# Altium schematic sheet NRF51822.SchDoc
size A
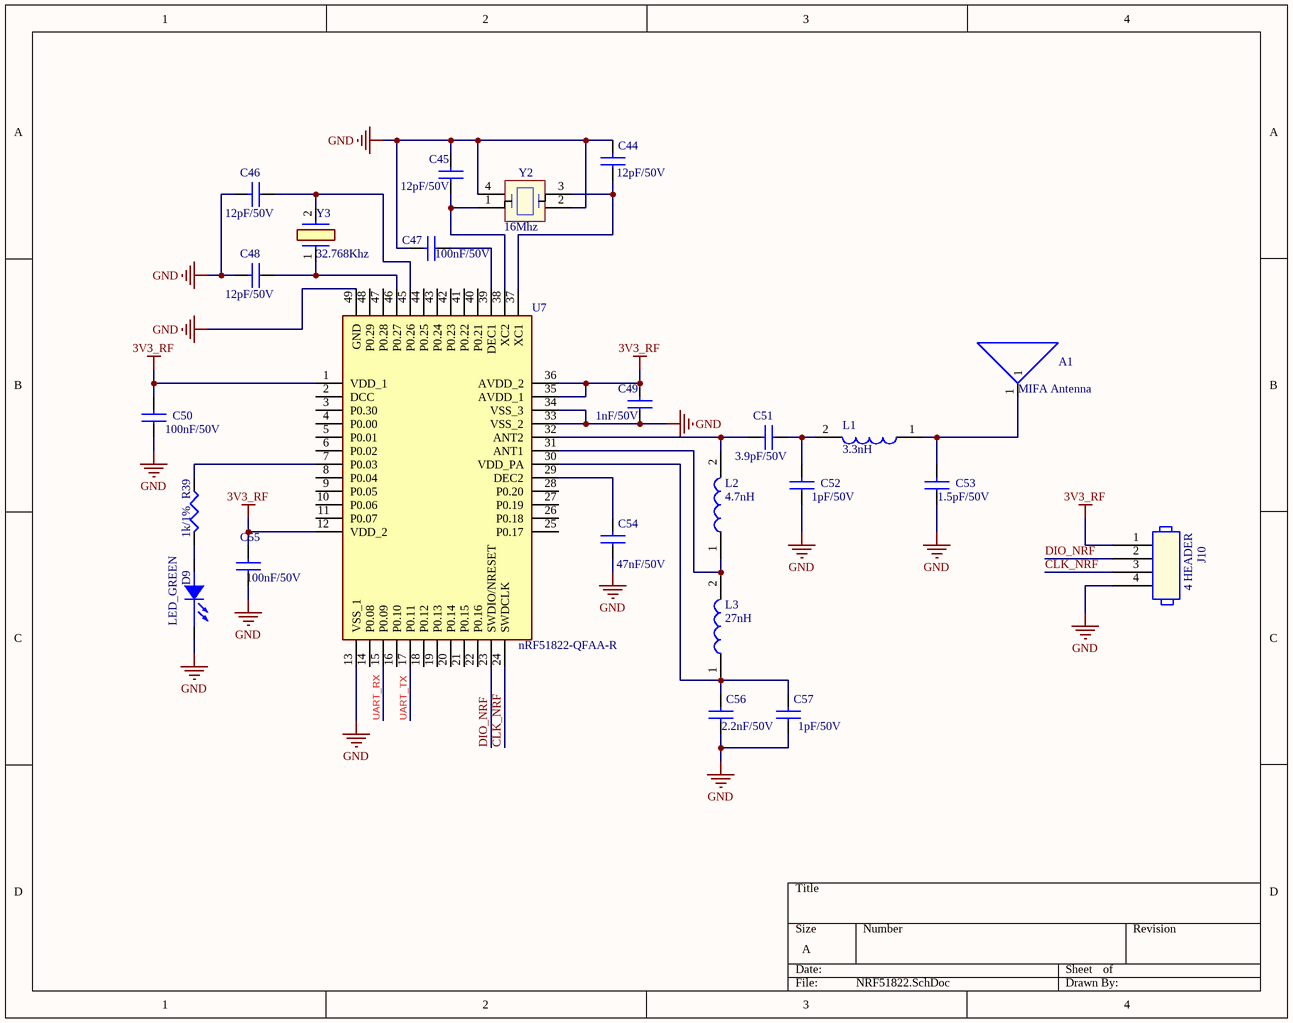
[diagram p0: NRF51822.SchDoc]

## Parts
A1  MIFA Antenna  [ANT-2.4GHZ-8.0X1.0MM]  (no BOM)
C44  12pF/50V  [C0402]
C45  12pF/50V  [C0402]
C46  12pF/50V  [C0402]
C47  100nF/50V  [C0402]
C48  12pF/50V  [C0402]
C49  1nF/50V  [C0402]
C50  100nF/50V  [C0402]
C51  3.9pF/50V  [C0402]
C52  1pF/50V  [C0402]
C53  1.5pF/50V  [C0402]
C54  47nF/50V  [C0402]
C55  100nF/50V  [C0402]
C56  2.2nF/50V  [C0402]
C57  1pF/50V  [C0402]
D9  LED_GREEN  [LED0603]
J10  4 HEADER  [ISP-4P-2_54]
L1  3.3nH  [LQG15WH0N7B02D]
L2  4.7nH  [LQG15WH0N7B02D]
L3  27nH  [LQG15WH0N7B02D]
R39  1k/1%  [R0402]
U7  nRF51822-QFAA-R  [QFN40P600X600X95-49N-D]
Y2  16Mhz  [Q22FA12800400]
Y3  32.768Khz  [ABS0532768KHZ9T]

## Nets
3V3_RF: C49.2 C50.2 C55.2 J10.1 U7.1(VDD_1) U7.12(VDD_2) U7.35(AVDD_1) U7.36(AVDD_2)
GND: C44.2 C45.2 C46.2 C47.2 C48.2 C49.1 C50.1 C52.1 C53.1 C54.1 C55.1 C56.1 C57.1 D9.1(CATHODE) J10.4 U7.13(VSS_1) U7.33(VSS_2) U7.34(VSS_3) U7.49(GND) Y2.2(GND_1) Y2.4(GND_2)
CLK_NRF: J10.3 U7.24(SWDCLK)
DIO_NRF: J10.2 U7.23(SWDIO/NRESET)
UART_RX: U7.15(P0.09)
UART_TX: U7.17(P0.11)
NetA1_1: A1.1 C53.2 L1.1
NetC44_1: C44.1 U7.37(XC1) Y2.3(CRYSTAL_2)
NetC45_1: C45.1 U7.38(XC2) Y2.1(CRYSTAL_1)
NetC46_1: C46.1 U7.45(P0.26) Y3.2
NetC47_1: C47.1 U7.39(DEC1)
NetC48_1: C48.1 U7.46(P0.27) Y3.1
NetC51_1: C51.1 C52.2 L1.2
NetC51_2: C51.2 L2.2 U7.32(ANT2)
NetC54_2: C54.2 U7.29(DEC2)
NetC56_2: C56.2 C57.2 L3.1 U7.30(VDD_PA)
NetD9_2: D9.2(ANODE) R39.1
NetL2_1: L2.1 L3.2 U7.31(ANT1)
NetR39_2: R39.2 U7.7(P0.03)

Not connected (* = marked no-connect by the designer): U7 2(DCC) 3(P0.30) 4(P0.00) 5(P0.01) 6(P0.02) 8(P0.04) 9(P0.05) 10(P0.06) 11(P0.07) 14(P0.08) 16(P0.10) 18(P0.12) 19(P0.13) 20(P0.14) 21(P0.15) 22(P0.16) 25(P0.17) 26(P0.18) 27(P0.19) 28(P0.20) 40(P0.21) 41(P0.22) 42(P0.23) 43(P0.24) 44(P0.25) 47(P0.28) 48(P0.29)

## Library data of the parts
A1 = Ceramic _ANTENNA: None; AMBIQ PN: PCB_ANTENNA
C44-C57 = CAP NP: PCB Footprint: C0402
D9 = LED: PCB Footprint: LED0603
L1-L3 = LQG15HS4N7C02D: Inductor; Manufacturer_Name: Murata Electronics; Datasheet Link: https://search.murata.co.jp/Ceramy/image/img/P02/JELF243B-0010.pdf; Height: 0.6mm; Manufacturer_Part_Number: LQG15HS4N7C02D; Mouser Part Number: 81-LQG15HS4N7C02D; Mouser Price/Stock: https://www.mouser.co.uk/ProductDetail/Murata-Electronics/LQG15HS4N7C02D?qs=60uY6ySkanQsgm4t8ngjFA%3D%3D; Arrow Part Number: LQG15HS4N7C02D; Arrow Price/Stock: https://www.arrow.com/en/products/lqg15hs4n7c02d/murata-manufacturing
R39 = RESISTOR: PCB Footprint: R0402
U7 = nRF51822-QFAA-R: Integrated Circuit; Manufacturer_Name: Nordic Semiconductor; Datasheet Link: https://datasheet.datasheetarchive.com/originals/distributors/Datasheets-DGA5/435665.pdf; Height: 0.95mm; Manufacturer_Part_Number: nRF51822-QFAA-R; Mouser Part Number: 949-NRF51822-QFAA-R; Mouser Price/Stock: https://www.mouser.co.uk/ProductDetail/Nordic-Semiconductor/nRF51822-QFAA-R?qs=7xCC5jQa1OJP%2FZdtChopZw%3D%3D; Arrow Part Number: NRF51822-QFAA-R; Arrow Price/Stock: https://www.arrow.com/en/products/nrf51822-qfaa-r/nordic-semiconductor?utm_currency=USD&region=nac
Y2 = Q22FA12800400: Crystal or Oscillator; Manufacturer_Name: Seiko Epson Corporation; Datasheet Link: https://datasheet.lcsc.com/szlcsc/Seiko-Epson-Q22FA12800400_C255875.pdf; Height: 0.5mm; Manufacturer_Part_Number: Q22FA12800400
Y3 = ABS05-32.768KHZ-9-T: Crystal or Oscillator; Manufacturer_Name: ABRACON; Datasheet Link: https://abracon.com/Resonators/ABS05.pdf; Height: 0.5mm; Manufacturer_Part_Number: ABS05-32.768KHZ-9-T; Mouser Part Number: 815-ABS05-32.768K9T; Mouser Price/Stock: https://www.mouser.co.uk/ProductDetail/ABRACON/ABS05-32.768KHZ-9-T?qs=Pyu0ZBy%2FIJbsNYnIET1z3A%3D%3D; Arrow Part Number: ABS05-32.768KHZ-9-T; Arrow Price/Stock: https://www.arrow.com/en/products/abs05-32.768khz-9-t/abracon?region=nac
J10 = 4 HEADER: PCB Footprint: ISP-4P-2_54